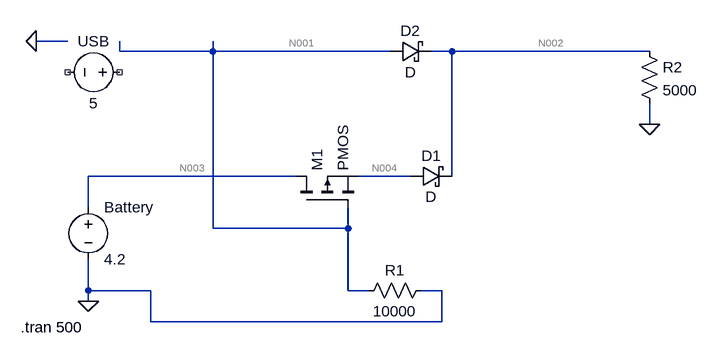
[diagram p0: schematic Power Circuit.asc]
Power Circuit.asc, the LTspice schematic file:
Version 4
SHEET 1 880 680
WIRE -128 -80 -176 -80
WIRE -48 -64 -48 -80
WIRE 96 -64 96 -80
WIRE 96 -64 -48 -64
WIRE 368 -64 96 -64
WIRE 464 -64 432 -64
WIRE 768 -64 464 -64
WIRE 768 48 768 16
WIRE 224 128 -96 128
WIRE 400 128 320 128
WIRE 464 128 464 -64
WIRE -96 176 -96 128
WIRE 96 208 96 -64
WIRE 304 208 304 176
WIRE 304 208 96 208
WIRE -96 304 -96 256
WIRE 0 304 -96 304
WIRE 304 304 304 208
WIRE 336 304 304 304
WIRE 448 304 416 304
WIRE -96 320 -96 304
WIRE 0 352 0 304
WIRE 448 352 448 304
WIRE 448 352 0 352
FLAG -96 320 0
FLAG 768 48 0
FLAG -176 -80 0
SYMBOL pmos 224 176 R270
SYMATTR InstName M1
SYMBOL res 432 288 R90
WINDOW 0 0 56 VBottom 2
WINDOW 3 32 56 VTop 2
SYMATTR InstName R1
SYMATTR Value 10000
SYMBOL schottky 400 144 R270
WINDOW 0 32 32 VTop 2
WINDOW 3 0 32 VBottom 2
SYMATTR InstName D1
SYMBOL schottky 368 -48 R270
WINDOW 0 32 32 VTop 2
WINDOW 3 0 32 VBottom 2
SYMATTR InstName D2
SYMBOL voltage -96 160 R0
SYMATTR InstName Battery
SYMATTR Value 4.2
SYMBOL voltage -32 -32 R90
WINDOW 0 -32 56 VBottom 2
WINDOW 3 32 56 VTop 2
WINDOW 123 0 0 Left 0
WINDOW 39 0 0 Left 0
SYMATTR InstName USB
SYMATTR Value 5
SYMBOL res 752 -80 R0
SYMATTR InstName R2
SYMATTR Value 5000
TEXT -200 360 Left 2 !.tran 500

The netlist it stands for:
* Power Circuit.asc
M1 N003 N001 N004 N004 PMOS
R1 0 N001 10000
D1 N004 N002 D
D2 N001 N002 D
V§Battery N003 0 4.2
V§USB NC_01 NC_02 5
R2 N002 0 5000
.model D D
.lib standard.dio
.model NMOS NMOS
.model PMOS PMOS
.lib standard.mos
.tran 500
.backanno
.end

* Results of the author's LTspice run, read from the files saved beside the schematic
* Operating Point, zero values left out:
*   V(n003) = 4.2 V
*   V(n001) = 29.3 nV
*   V(n004) = 3.561 V
*   V(n002) = 2.92 V
*   Id(M1) = 584 µA
*   Ib(M1) = -534.4 µA
*   Is(M1) = -49.59 µA
*   I(D2) = -2.93 pA
*   I(D1) = 584 µA
*   I(R2) = 584 µA
*   I(R1) = -2.93 pA
*   I(Battery) = -584 µA